# EAGLE design MPU6050 (EAGLE 9.3.0)
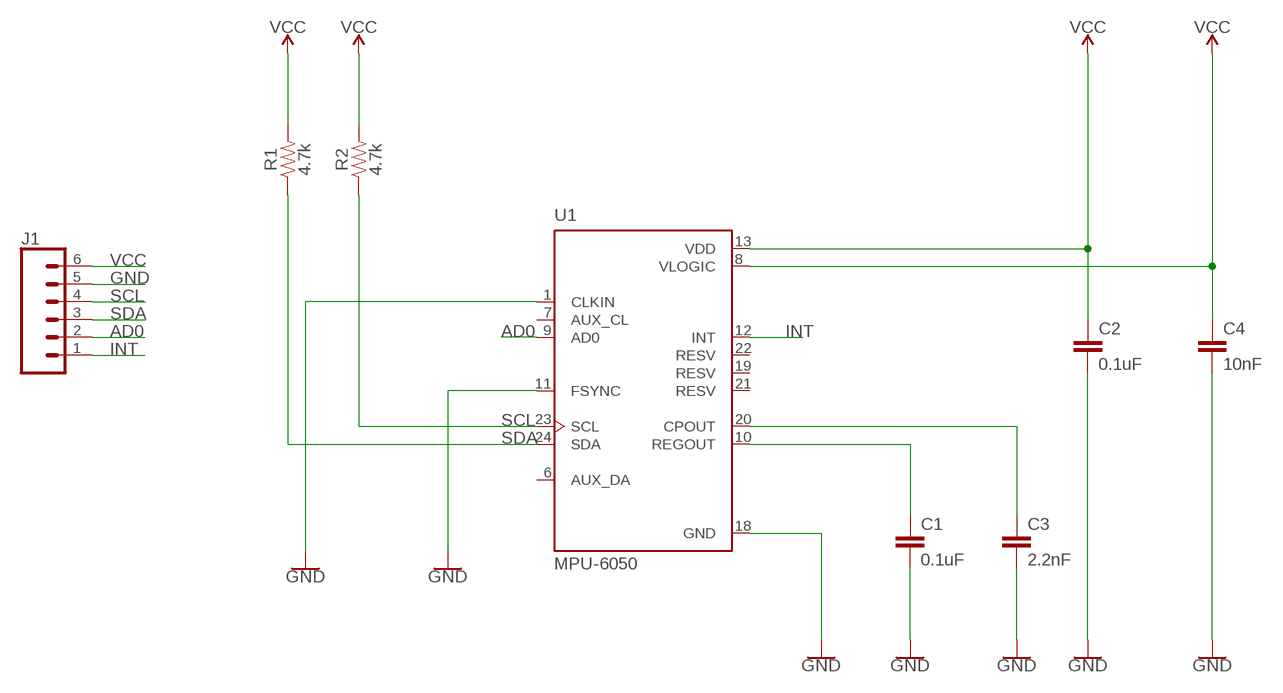
[diagram p0: schematic, sheet 1]

## Parts
C1  0.1uF  1.0UF-0805-25V-10%  [0805]
C2  0.1uF  1.0UF-0805-25V-10%  [0805]
C3  2.2nF  1.0UF-0805-25V-10%  [0805]
C4  10nF  1.0UF-0805-25V-10%  [0805]
J1  CONN_06NO_SILK_FEMALE_PTH  [1X06_NO_SILK]
R1  4.7k  RESISTOR0805  [0805]
R2  4.7k  RESISTOR0805  [0805]
U1  MPU-6050  [QFN50P400X400X95-24N]

## Nets
AD0: J1.2 U1.9(AD0)
GND: C1.2 C2.2 C3.2 C4.2 J1.5 U1.1(CLKIN) U1.11(FSYNC) U1.18(GND)
INT: J1.1 U1.12(INT)
N$1: C1.1 U1.10(REGOUT)
N$2: C3.1 U1.20(CPOUT)
SCL: J1.4 R2.1 U1.23(SCL)
SDA: J1.3 R1.1 U1.24(SDA)
VCC: C2.1 C4.1 J1.6 R1.2 R2.2 U1.8(VLOGIC) U1.13(VDD)
Unconnected: U1.6(AUX_DA) U1.7(AUX_CL) U1.19(RESV) U1.21(RESV) U1.22(RESV)

## Library data of the parts
C1-C4 = SparkFun-Capacitors:1.0UF: 1µF ceramic capacitors A capacitor is a passive two-terminal electrical component used to store electrical energy temporarily in an electric field.; PROD_ID: CAP-08064; VALUE: 1.0uF
J1 = SparkFun-Connectors:CONN_06: Multi connection point. Often used as Generic Header-pin footprint for 0.1 inch spaced/style header connections On any of the 0.1 inch spaced packages, you can populate with these: Break Away Headers - Straight <https://www.sparkfun.com/products/116> (PRT-00116) Break Away Male Headers - Right Angle <https://www.sparkfun.com/products/553> (PRT-00553) Female Headers <https://www.sparkfun.com/products/115> (PRT-00115) Break Away Headers - Machine Pin <https://www.sparkfun.com/products/117> (PRT-00117) Break Away Female Headers - Swiss Machine Pin <https://www.sparkfun.com/products/743> (PRT-00743) Arduino Stackable Header - 6 Pin <https://www.sparkfun.com/products/9280> (PRT-09280) For SCREWTERMINALS and SPRING TERMINALS visit here: Screw Terimnals on SparkFun.com <https://www.sparkfun.com/search/results?term=Screw+Terminals> (5mm/3.5mm/2.54mm spacing) This device is also useful as a general connection point to wire up your design to another part of your project. Our various solder wires solder well into these plated through hole pads. Hook-Up Wire - Assortment (Stranded, 22 AWG) <https://www.sparkfun.com/products/11375> (PRT-11375) Hook-Up Wire - Assortment (Solid Core, 22 AWG) <https://www.sparkfun.com/products/11367> (PRT-11367) View the entire wire category on our website here <https://www.sparkfun.com/categories/141>; PROD_ID: CONN-08437
R1 R2 = SparkFun-Resistors:RESISTOR: Generic Resistor Package
U1 = MPU-6050:MPU-6050: MPU-6050 Six-Axis (Gyro + Accelerometer) MEMS MotionTracking™ Devices; DESCRIPTION: 3-axis gyroscope, 3-axis accelerometer in a 4x4x0.9 housing; DIGI-KEY_PART_NUMBER: 1428-1007-1-ND; DIGI-KEY_PURCHASE_URL: https://www.digikey.co.uk/product-detail/en/tdk-invensense/MPU-6050/1428-1007-1-ND/4038010?utm_source=snapeda&utm_medium=aggregator&utm_campaign=symbol; MF: TDK InvenSense; MP: MPU-6050; PACKAGE: QFN-24 InvenSense

## Board
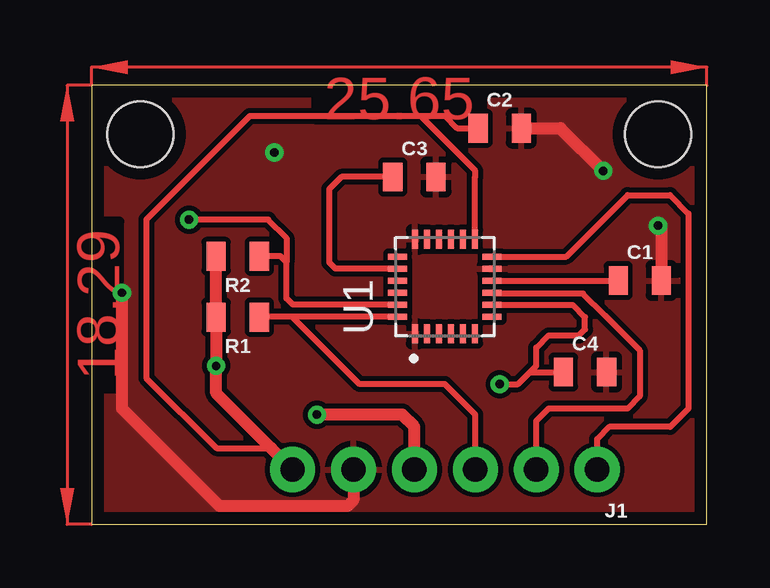
[diagram p1: board, top side]
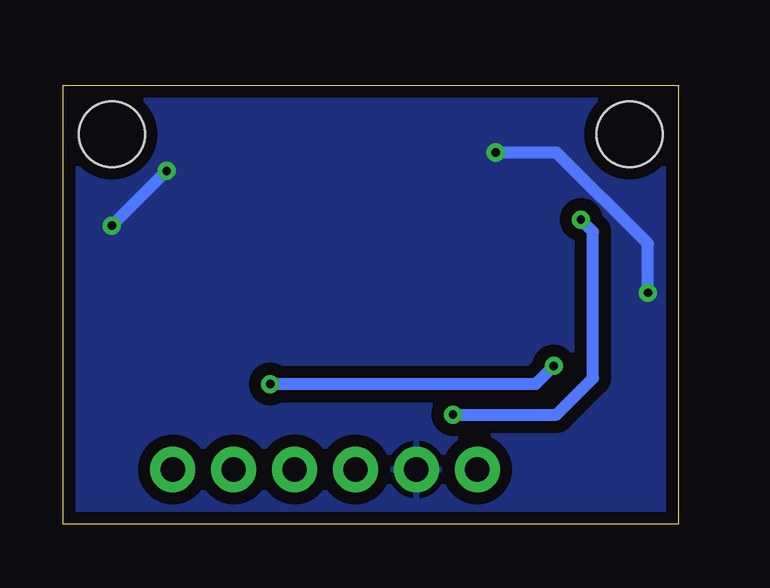
[diagram p2: board, bottom side, seen from below]

Size 25.65 x 18.29 mm. Coordinates in mm from the lower left corner, seen from the top.
Outline: 0,0 25.65,0 25.65,18.29 0,18.29 0,0
Copper layers (1*16): Top 0.035mm / dielectric 1.5mm / Bottom 0.035mm
Design rules "default *": minimum track width 8mil, minimum drill 0.35mm, track to track 8mil, track to pad 8mil, pad to pad 8mil, via to via 8mil, smd to smd 8mil, copper to edge 20mil, drill to drill 6mil, minimum pad ring 10mil, minimum via ring 8mil, stop-mask expansion 4mil, vias tented up to drill 0mil, thermal gap 10mil
Holes 2.75 mm at 2.03,16.26 23.62,16.26

### Footprints (pad centres in the part's own frame; a part is rotated, then mirrored left to right if it is on the bottom)
0805 = smd 0.8 x 1.2: 1 -0.9,0; 2 0.9,0
1X06_NO_SILK = drill 1.016 pad 1.88: 1 0,0; 2 2.54,0; 3 5.08,0; 4 7.62,0; 5 10.16,0; 6 12.7,0
QFN50P400X400X95-24N = smd 0.79 x 0.26: 1 -1.97,1.25; 2 -1.97,0.75; 3 -1.97,0.25; 4 -1.97,-0.25; 5 -1.97,-0.75; 6 -1.97,-1.25; 13 1.97,-1.25; 14 1.97,-0.75; 15 1.97,-0.25; 16 1.97,0.25; 17 1.97,0.75; 18 1.97,1.25 | smd 0.26 x 0.79: 7 -1.25,-1.97; 8 -0.75,-1.97; 9 -0.25,-1.97; 10 0.25,-1.97; 11 0.75,-1.97; 12 1.25,-1.97; 19 1.25,1.97; 20 0.75,1.97; 21 0.25,1.97; 22 -0.25,1.97; 23 -0.75,1.97; 24 -1.25,1.97

### Placement (x,y rotation side)
C1  22.86,10.16 0 top
C2  17.02,16.51 0 top
C3  13.46,14.48 0 top
C4  20.57,6.35 0 top
J1  21.08,2.29 180 top
R1  6.1,8.64 180 top
R2  6.1,11.18 180 top
U1  14.73,9.91 90 top

### Tracks (layer width: path | path; a pad name or v marks a point on that pad's centre or on a via)
AD0
  Top 0.254: J1.2 18.54,4.32 19.05,4.83 22.35,4.83 22.86,5.33 22.86,7.25 21.41,8.71 20.49,9.62 16.74,9.62 U1.9
GND  (via drill 0.35)
  Top 0.508: C2.2 19.56,16.51 v21.34,14.73 | v23.62,12.45 23.76,12.31 C1.2 | J1.5 10.92,1.02 10.67,0.76 5.33,0.76 1.27,4.83 v1.27,9.65
  Bottom 0.508: v21.34,14.73 v23.62,12.45 | v1.27,9.65 1.27,11.68 5.08,15.49 v7.62,15.49
  pour Top (isolate 0.203): 0,18.29 0,0 25.65,0 25.65,18.29
  pour Bottom (isolate 0.508): 0,18.29 0,0 25.65,0 25.65,18.29
INT
  Top 0.254: J1.1 21.08,3.56 21.59,4.06 24.13,4.06 24.89,4.83 24.89,12.95 24.13,13.72 22.35,13.72 19.79,11.16 U1.12
N$1
  Top 0.254: U1.10 C1.1
N$2
  Top 0.254: U1.20 12.75,10.67 10.16,10.67 9.91,10.92 9.91,13.97 10.41,14.48 C3.1
SCL  (via drill 0.35)
  Top 0.254: U1.23 8.39,9.16 8.13,9.42 8.13,10.92 | 8.13,10.92 7.87,11.18 R2.1 | 8.13,10.92 8.13,11.94 7.37,12.7 v4.06,12.7
  Top 0.508: J1.4 13.46,4.06 12.95,4.57 v9.4,4.57
  Bottom 0.508: v9.4,4.57 5.08,4.57 3.56,6.1 3.56,12.19 v4.06,12.7
SDA
  Top 0.254: 8.38,8.66 8.13,8.66 7.02,8.66 R1.1 | J1.3 16,4.57 14.73,5.84 11.18,5.84 8.38,8.64 8.38,8.66 | U1.24 8.38,8.66
VCC  (via drill 0.35)
  Top 0.254: 7.49,3.17 5.21,3.17 2.29,6.1 2.29,12.7 6.6,17.02 13.72,17.02 | U1.8 16.71,9.14 20.07,9.14 20.57,8.64 20.57,8.13 20.32,7.87 19.05,7.87 18.54,7.37 18.54,6.6 18.29,6.35 | v17.02,5.84 17.78,5.84 18.29,6.35 | 18.29,6.35 C4.1 | 13.72,17.02 16,14.73 16,14.48 15.98,14.46 U1.13 | 13.72,17.02 14.73,17.02 15.24,16.51 C2.1
  Top 0.508: J1.6 7.49,3.17 5.2,5.47 v5.2,6.6 R1.2 R2.2
  Bottom 0.508: v5.2,6.6 5.96,5.84 v17.02,5.84
(copper drawn outside any net)
  shapes: Top area x2